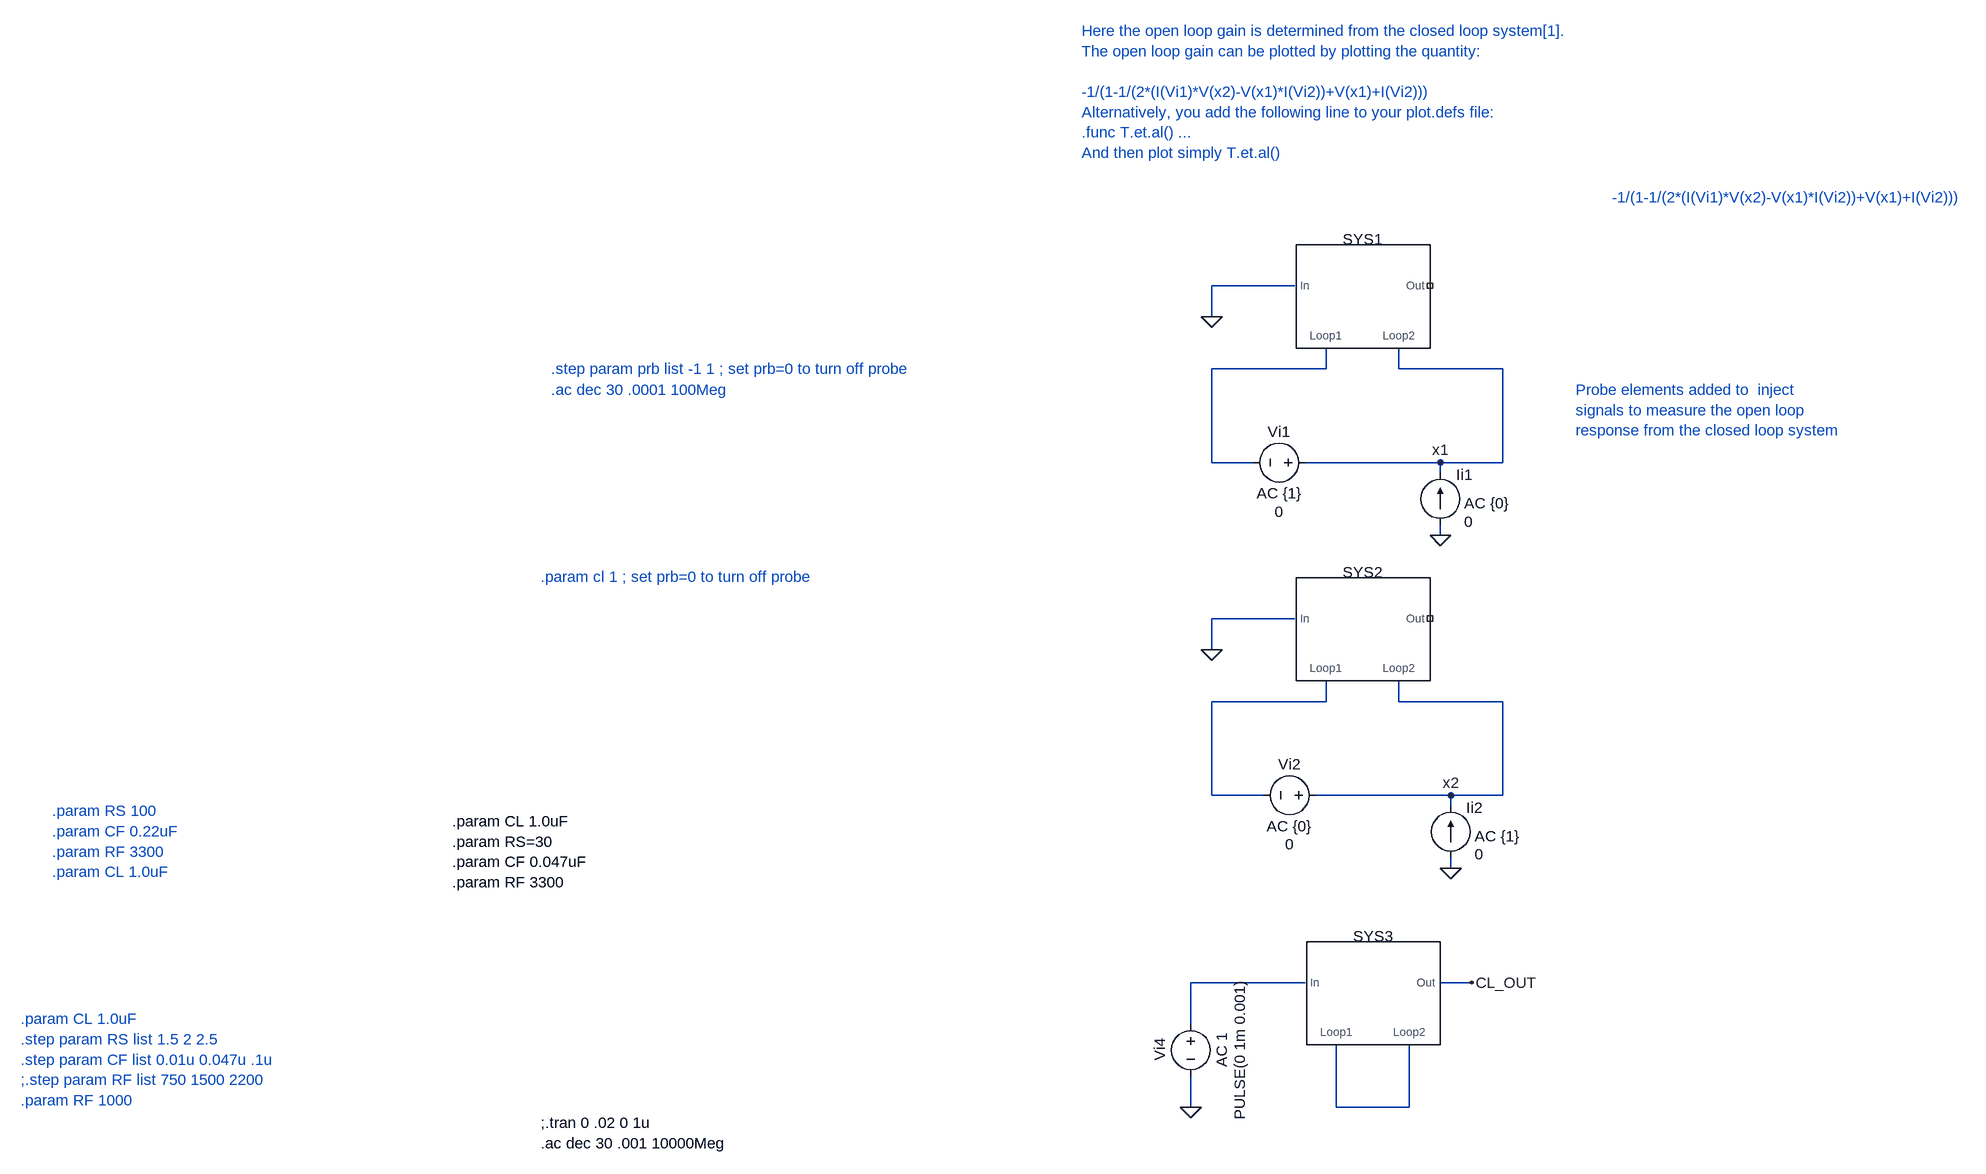
[diagram p0: schematic system analysis02t.asc]
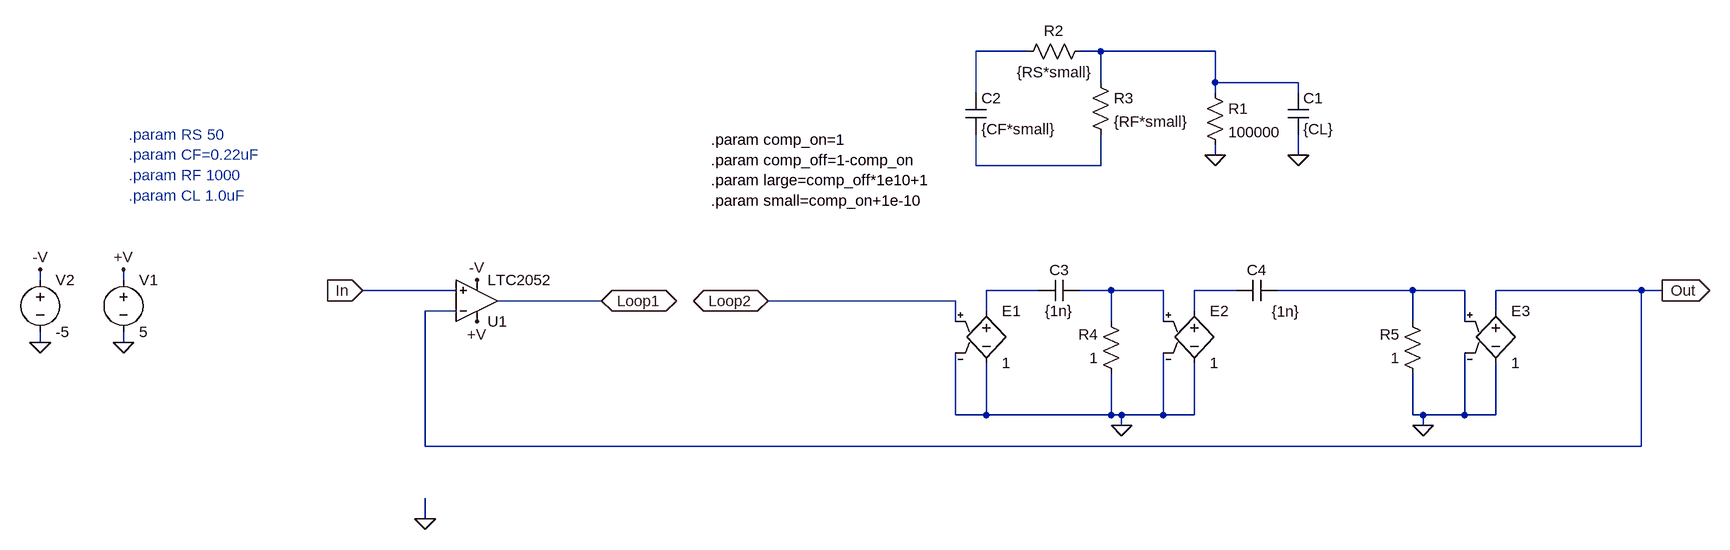
[diagram p1: sub-circuit system_model.asc]
* system analysis02t.asc
Ii1 0 x1 0 AC {0}
Vi1 x1 N001 0 AC {1}
Ii2 0 x2 0 AC {1}
Vi2 x2 N002 0 AC {0}
XSYS1 0 N001 x1 NC_01 system_model
XSYS2 0 N002 x2 NC_02 system_model
XSYS3 N003 N004 N004 CL_OUT system_model
Vi4 N003 0 PULSE(0 1m 0.001) AC 1

* block symbol definitions
.subckt system_model In Loop1 Loop2 Out
R1 N002 0 100000
C1 N002 0 {CL}
R2 N002 N001 {RS*small}
* U1: LTC2052 (symbol Opamps\LTC2052 not available, pins judged from their places): In+=In In-=Out V+=+V V-=-V OUT=Loop1
C2 N001 N003 {CF*small}
R3 N002 N003 {RF*small}
V1 +V 0 5
V2 -V 0 -5
R4 0 N005 1
C3 N005 N004 {1n}
E1 N004 0 Loop2 0 1
E2 N006 0 N005 0 1
R5 0 N007 1
C4 N007 N006 {1n}
E3 Out 0 N007 0 1
.param comp_on=1
.param comp_off=1-comp_on
.param large=comp_off*1e10+1
.param small=comp_on+1e-10
* .param RS 50
* .param CF=0.22uF
* .param RF 1000
* .param CL 1.0uF
.ends system_model

* .ac dec 30 .0001 100Meg
* Here the open loop gain is determined from the closed loop system[1].
* The open loop gain can be plotted by plotting the quantity:
* -1/(1-1/(2*(I(Vi1)*V(x2)-V(x1)*I(Vi2))+V(x1)+I(Vi2)))
* Alternatively, you add the following line to your plot.defs file:
* .func T.et.al() ...
* And then plot simply T.et.al()
* .step param prb list -1 1 ; set prb=0 to turn off probe
* Probe elements added to  inject
* signals to measure the open loop
* response from the closed loop system
* .param cl 1 ; set prb=0 to turn off probe
* -1/(1-1/(2*(I(Vi1)*V(x2)-V(x1)*I(Vi2))+V(x1)+I(Vi2)))
;.tran 0 .02 0 1u
.ac dec 30 .001 10000Meg
.param CL 1.0uF
.param RS=30
.param CF 0.047uF
.param RF 3300
* .param RS 100
* .param CF 0.22uF
* .param RF 3300
* .param CL 1.0uF
* .param CL 1.0uF
* .step param RS list 1.5 2 2.5
* .step param CF list 0.01u 0.047u .1u
* ;.step param RF list 750 1500 2200
* .param RF 1000
.backanno
.end

* Results of the author's LTspice run, read from the files saved beside the schematic
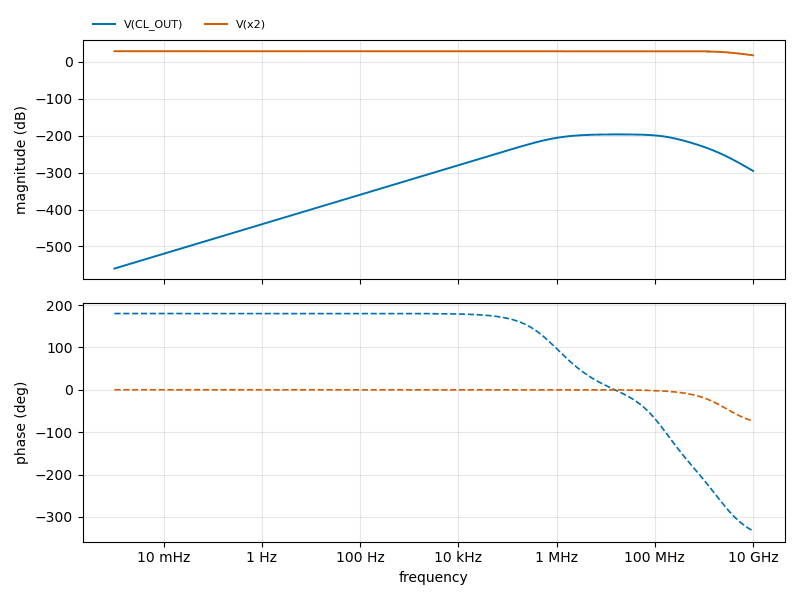
[diagram p2: AC Analysis of system analysis02t.asc, plotted from the saved traces]
* AC Analysis, 1 run:
*   V(CL_OUT): -559.77 dB at 1 mHz, -295.40 dB at 10 GHz, peak -196.48 dB at 18.48 MHz, 3 dB below the peak at 2.577 MHz and 106.4 MHz
*   V(x2): 28.82 dB at 1 mHz, 17.67 dB at 10 GHz, peak 28.82 dB at 1 mHz, 3 dB below the peak at 2.883 GHz